# EAGLE design Filter (EAGLE 9.2.2)
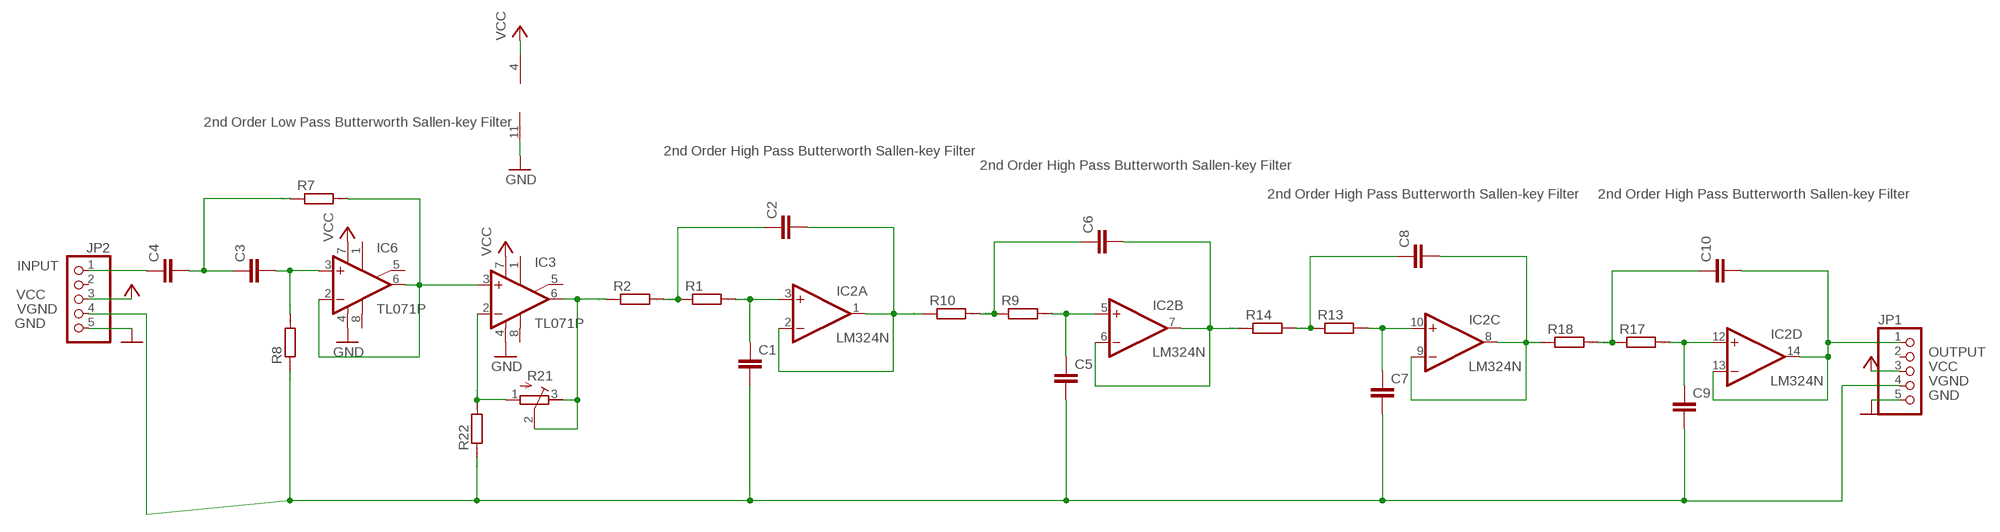
[diagram p0: schematic, sheet 1]

## Parts
C1  C2.5/2  [C2.5-2]
C2  C2.5/2  [C2.5-2]
C3  C2.5/2  [C2.5-2]
C4  C2.5/2  [C2.5-2]
C5  C2.5/2  [C2.5-2]
C6  C2.5/2  [C2.5-2]
C7  C2.5/2  [C2.5-2]
C8  C2.5/2  [C2.5-2]
C9  C2.5/2  [C2.5-2]
C10  C2.5/2  [C2.5-2]
IC2  LM324N  [DIL14]
IC3  TL071P  [DIL08]
IC6  TL071P  [DIL08]
JP1  PINHD-1X5  [1X05]
JP2  PINHD-1X5  [1X05]
R1  R0204/7  [0204/7]
R2  R0204/7  [0204/7]
R7  R0204/7  [0204/7]
R8  R0204/7  [0204/7]
R9  R0204/7  [0204/7]
R10  R0207/10  [0207/10]
R13  R0204/7  [0204/7]
R14  R0204/7  [0204/7]
R17  R0204/7  [0204/7]
R18  R0207/10  [0207/10]
R21  R-TRIMM3299W  [RTRIM3299W]
R22  R0204/7  [0204/7]

## Nets
GND: IC2.11(P:V-) IC3.4(V-) IC6.4(V-) JP1.5 JP2.5
INPUT: C4.1 JP2.1
N$1: C2.1 R1.1 R2.2
N$2: C1.1 IC2.3(A:+IN) R1.2
N$4: C2.2 IC2.1(A:OUT) IC2.2(A:-IN) R10.1
N$5: IC3.6(OUT) R2.1 R21.2(S) R21.3(E)
N$11: C3.1 C4.2 R7.1
N$12: C6.1 R9.1 R10.2
N$13: C3.2 IC6.3(+IN) R8.2
N$14: IC3.3(+IN) IC6.2(-IN) IC6.6(OUT) R7.2
N$15: C6.2 IC2.6(B:-IN) IC2.7(B:OUT) R14.1
N$18: C5.1 IC2.5(B:+IN) R9.2
N$20: C8.1 R13.1 R14.2
N$21: C8.2 IC2.8(C:OUT) IC2.9(C:-IN) R18.1
N$24: C7.1 IC2.10(C:+IN) R13.2
N$26: C10.1 R17.1 R18.2
N$30: C9.1 IC2.12(D:+IN) R17.2
N$43: IC3.2(-IN) R21.1(A) R22.2
OUTPUT: C10.2 IC2.13(D:-IN) IC2.14(D:OUT) JP1.1
VCC: IC2.4(P:V+) IC3.7(V+) IC6.7(V+) JP1.3 JP2.3
VGND: C1.2 C5.2 C7.2 C9.2 JP1.4 JP2.4 R8.1 R22.1
Unconnected: IC3.1(ON1) IC3.5(ON2) IC3.8(OPT) IC6.1(ON1) IC6.5(ON2) IC6.8(OPT) JP1.2 JP2.2

## Notes on the sheet
- 2nd Order Low Pass Butterworth Sallen-key Filter
- 2nd Order High Pass Butterworth Sallen-key Filter
- 2nd Order High Pass Butterworth Sallen-key Filter
- 2nd Order High Pass Butterworth Sallen-key Filter | 2nd Order High Pass Butterworth Sallen-key Filter

## Library data of the parts
C1-C10 = capacitor-wima:C: CAPACITOR naming: grid - package width
IC2 = linear:LM324: OP AMP
IC3 IC6 = linear:TL071: OP AMP
JP1 JP2 = pinhead:PINHD-1X5: PIN HEADER
R1 R2 R7-R10 R13 R14 R17 R18 R22 = eagle-ltspice:R: RESISTOR, European symbol; SPICEMODEL: NONE; SPICEPREFIX: R
R21 = resistor:R-TRIMM: Trimm resistor

## Board
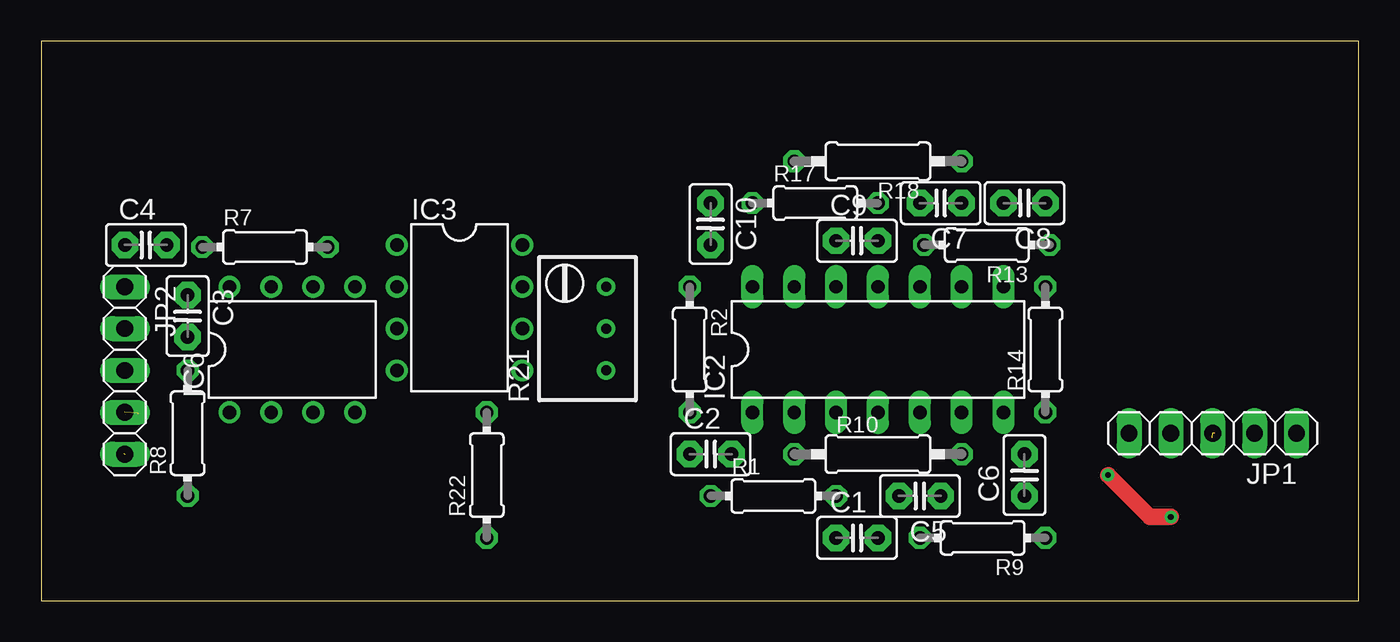
[diagram p1: board, top side]
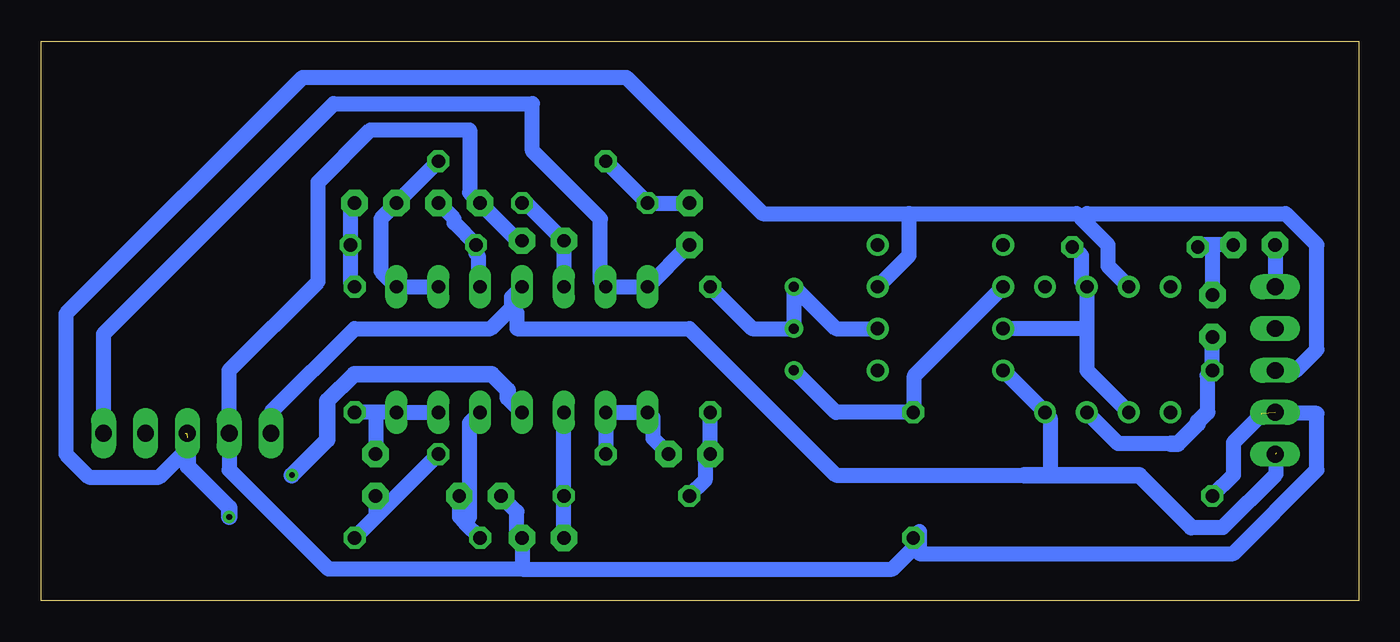
[diagram p2: board, bottom side, seen from below]

Size 79.99 x 33.96 mm. Coordinates in mm from the lower left corner, seen from the top.
Outline: 0,0 79.99,0 79.99,33.96 0,33.96 0,0
Copper layers (1*16): Top 0.035mm / dielectric 1.5mm / Bottom 0.035mm
Design rules "default *": minimum track width 0.9mm, minimum drill 0.35mm, track to track 0.5mm, track to pad 0.5mm, pad to pad 0.5mm, via to via 0.5mm, smd to smd 6mil, copper to edge 40mil, drill to drill 6mil, minimum pad ring 10mil, minimum via ring 8mil, stop-mask expansion 4mil, vias tented up to drill 0mil, thermal gap 10mil

### Footprints (pad centres in the part's own frame; a part is rotated, then mirrored left to right if it is on the bottom)
C2.5-2 = drill 0.813 pad 1.6 octagon: 1 -1.27,0; 2 1.27,0
DIL14 = drill 0.813 long: 1 -7.62,-3.81; 2 -5.08,-3.81; 3 -2.54,-3.81; 4 0,-3.81; 5 2.54,-3.81; 6 5.08,-3.81; 7 7.62,-3.81; 8 7.62,3.81; 9 5.08,3.81; 10 2.54,3.81; 11 0,3.81; 12 -2.54,3.81; 13 -5.08,3.81; 14 -7.62,3.81
DIL08 = drill 0.813 pad 1.27: 1 -3.81,-3.81; 2 -1.27,-3.81; 3 1.27,-3.81; 4 3.81,-3.81; 5 3.81,3.81; 6 1.27,3.81; 7 -1.27,3.81; 8 -3.81,3.81
1X05 = drill 1.016 long: 1 -5.08,0; 2 -2.54,0; 3 0,0; 4 2.54,0; 5 5.08,0
0204/7 = drill 0.813 octagon: 1 -3.81,0; 2 3.81,0
0207/10 = drill 0.813 octagon: 1 -5.08,0; 2 5.08,0
RTRIM3299W = drill 0.61: 1 1.27,-2.54; 2 1.27,0; 3 1.27,2.54

### Placement (x,y rotation side)
C1  49.53,3.81 0 top
C2  40.64,8.89 0 top
C3  8.89,17.27 270 top
C4  6.35,21.59 0 top
C5  53.34,6.35 180 top
C6  59.69,7.62 90 top
C7  54.61,24.13 180 top
C8  59.69,24.13 180 top
C9  49.53,21.84 0 top
C10  40.64,22.86 270 top
IC2  50.8,15.24 0 top
IC3  25.4,17.78 270 top
IC6  15.24,15.24 0 top
JP1  71.12,10.16 180 top
JP2  5.08,13.97 270 top
R1  44.45,6.35 0 top
R2  39.37,15.24 270 top
R7  13.59,21.46 0 top
R8  8.89,10.16 90 top
R9  57.15,3.81 180 top
R10  50.8,8.89 0 top
R13  57.4,21.59 180 top
R14  60.96,15.24 90 top
R17  46.99,24.13 0 top
R18  50.8,26.67 180 top
R21  33.02,16.51 0 top
R22  27.05,7.62 90 top

### Tracks (layer width: path | path; a pad name or v marks a point on that pad's centre or on a via)
GND  (1 unrouted)
  Bottom 0.9: IC3.4 IC6.4 18.73,11.11 18.73,7.62 20.32,7.62 31.75,7.62 40.64,16.51 51.12,16.51 51.12,17.46 51.44,17.78 | 5.02,8.95 5.02,7.68 8.26,4.45 10.16,4.45 | IC2.11 51.44,18.41 51.44,17.78 | 51.44,17.78 52.7,16.51 60.96,16.51 66.04,11.43 JP1.5
  Bottom 1: 10.16,4.45 13.34,7.62 20.32,7.62
INPUT
  Bottom 0.9: C4.1 JP2.1
N$1
  Bottom 0.9: R2.2 C2.1 39.69,8.57 39.69,7.3 R1.1
N$2
  Bottom 0.9: C1.1 R1.2 IC2.3
N$4
  Bottom 0.9: R10.1 IC2.2 IC2.1 42.86,11.11 42.86,9.84 C2.2
N$5
  Bottom 0.9: IC3.6 31.75,16.51 R21.3 R21.2 36.83,16.51 R2.1
N$11
  Bottom 0.9: C4.2 8.89,21.59 | 8.89,21.59 9.53,21.59 R7.1 | 8.89,21.59 C3.1
N$12
  Bottom 0.9: 59.69,5.08 R9.1 | C6.1 59.69,5.08 | 59.69,5.08 R10.2
N$13
  Bottom 0.9: IC6.3 14.61,9.53 11.43,9.53 | 9.21,11.43 9.21,13.65 R8.2 C3.2
  Bottom 1: 9.21,11.43 9.77,10.87 9.77,10.74 10.99,9.53 11.43,9.53
N$14
  Bottom 0.9: IC6.2 16.51,13.97 16.51,16.51 | 16.51,16.51 IC6.6 16.83,19.37 16.83,20.95 17.14,21.27 R7.2 | 16.51,16.51 IC3.3
N$15
  Bottom 0.9: IC2.6 IC2.7 59.69,11.43 | 59.69,11.43 R14.1 | 59.69,11.43 C6.2
N$18
  Bottom 0.9: 54.29,4.76 54.61,5.08 C5.1 | 54.29,4.76 R9.2 | IC2.5 53.98,10.79 53.98,5.08 54.29,4.76
N$20
  Bottom 0.9: R14.2 61.21,19.3 R13.1 61.21,23.88 C8.1
N$21
  Bottom 0.9: IC2.9 IC2.8 59.37,20 59.37,23.18 C8.2 R18.1
N$24
  Bottom 0.9: IC2.10 53.34,19.81 53.47,19.94 53.47,20.95 53.59,21.08 R13.2 54.93,22.92 54.93,23.18 C7.1
N$26
  Bottom 0.9: C10.1 R17.1 R18.2
N$30
  Bottom 0.9: IC2.12 C9.1 50.55,24.13 R17.2
N$43
  Bottom 0.9: R21.1 31.75,11.43 R22.2 26.99,11.75 26.99,13.65 IC3.2
OUTPUT
  Bottom 0.9: C10.2 IC2.14 IC2.13 46.04,19.37 46.04,23.18 50.16,27.3 50.16,30.16 62.23,30.16 76.2,16.19 JP1.1
VCC  (via drill 0.35)  (2 unrouted)
  Top 1: v68.58,5.08 67.31,5.08 v64.77,7.62
  Bottom 0.9: IC6.7 15.24,20.32 15.24,21.59 16.83,23.18 | 16.83,23.18 17.14,23.5 27.3,23.5 | 27.3,23.5 36.2,23.5 44.45,31.75 64.14,31.75 78.49,17.4 78.49,8.89 77.09,7.49 72.83,7.49 71.25,9.08 71.25,10.16 | 27.3,23.5 27.3,20.95 IC3.7 | 16.83,23.18 16.51,23.5 4.45,23.5 2.54,21.59 2.54,15.24 3.81,13.97 JP2.3
  Bottom 1: IC2.4 51.68,12.31 51.68,12.78 52.65,13.75 60.99,13.75 62.62,12.12 62.62,9.77 v64.77,7.62 | 71.1,9.89 71.1,8.16 68.58,5.64 v68.58,5.08
VGND  (2 unrouted)
  Bottom 0.9: R8.1 7.62,7.62 7.62,9.59 5.91,11.3 | C9.2 51.05,21.84 C7.2 53.98,24.77 53.98,28.57 60.01,28.57 63.18,25.4 63.18,19.37 68.58,13.97 JP1.4 68.58,7.94 62.55,1.91 50.8,1.91 | 50.8,1.91 28.32,1.91 27.05,3.17 R22.1 26.67,4.19 26.67,2.86 7.62,2.86 2.54,7.94 2.54,11.37 5.91,11.37 | 50.8,1.91 C1.2 51.12,4.13 51.12,5.4 C5.2